# EAGLE design Arduino_Euclidean_Board_Controls_top (EAGLE 9.1.1)
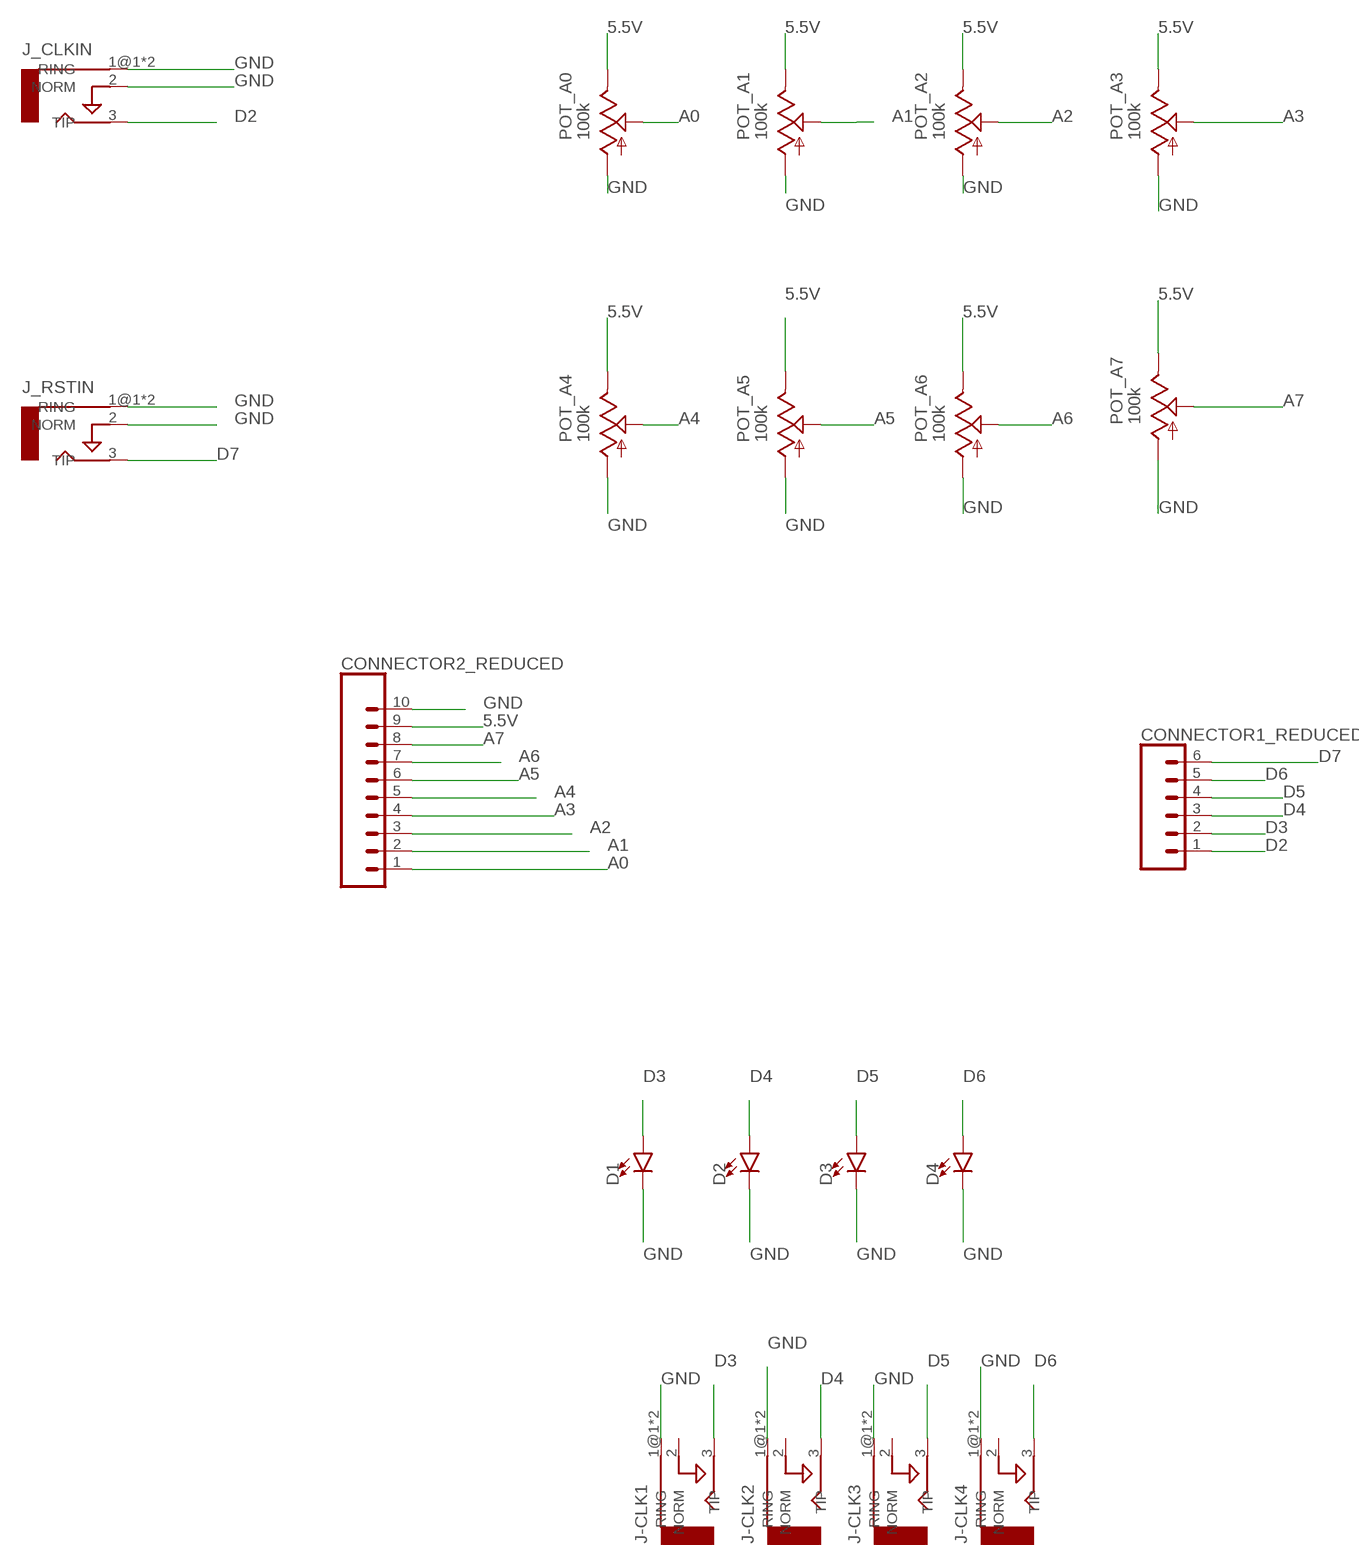
[diagram p0: schematic, sheet 1]

## Parts
CONNECTOR1_REDUCED  CONN_06LONGPADS  [1X06_LONGPADS]
CONNECTOR2_REDUCED  CONN_10_LONGPADS10_LONGPADS  [1X10_LONGPADS]
D1  LED-3MM-NO_SILK  [LED_3MM-NS]
D2  LED-3MM-NO_SILK  [LED_3MM-NS]
D3  LED-3MM-NO_SILK  [LED_3MM-NS]
D4  LED-3MM-NO_SILK  [LED_3MM-NS]
J-CLK1  AUDIO-JACKERTHENVAR  [ERTHENVAR-JACK]
J-CLK2  AUDIO-JACKERTHENVAR  [ERTHENVAR-JACK]
J-CLK3  AUDIO-JACKERTHENVAR  [ERTHENVAR-JACK]
J-CLK4  AUDIO-JACKERTHENVAR  [ERTHENVAR-JACK]
J_CLKIN  AUDIO-JACKERTHENVAR  [ERTHENVAR-JACK]
J_RSTIN  AUDIO-JACKERTHENVAR  [ERTHENVAR-JACK]
POT_A0  100k  9MM_SNAP-IN_POT_  [9MM_SNAP-IN_POT]
POT_A1  100k  9MM_SNAP-IN_POT_  [9MM_SNAP-IN_POT]
POT_A2  100k  9MM_SNAP-IN_POT_  [9MM_SNAP-IN_POT]
POT_A3  100k  9MM_SNAP-IN_POT_  [9MM_SNAP-IN_POT]
POT_A4  100k  9MM_SNAP-IN_POT_  [9MM_SNAP-IN_POT]
POT_A5  100k  9MM_SNAP-IN_POT_  [9MM_SNAP-IN_POT]
POT_A6  100k  9MM_SNAP-IN_POT_  [9MM_SNAP-IN_POT]
POT_A7  100k  9MM_SNAP-IN_POT_  [9MM_SNAP-IN_POT]

## Nets
5.5V: CONNECTOR2_REDUCED.9 POT_A0.3(E) POT_A1.3(E) POT_A2.3(E) POT_A3.3(E) POT_A4.3(E) POT_A5.3(E) POT_A6.3(E) POT_A7.3(E)
A0: CONNECTOR2_REDUCED.1 POT_A0.2(S)
A1: CONNECTOR2_REDUCED.2 POT_A1.2(S)
A2: CONNECTOR2_REDUCED.3 POT_A2.2(S)
A3: CONNECTOR2_REDUCED.4 POT_A3.2(S)
A4: CONNECTOR2_REDUCED.5 POT_A4.2(S)
A5: CONNECTOR2_REDUCED.6 POT_A5.2(S)
A6: CONNECTOR2_REDUCED.7 POT_A6.2(S)
A7: CONNECTOR2_REDUCED.8 POT_A7.2(S)
D2: CONNECTOR1_REDUCED.1 J_CLKIN.3(TIP)
D3: CONNECTOR1_REDUCED.2 D1.A J-CLK1.3(TIP)
D4: CONNECTOR1_REDUCED.3 D2.A J-CLK2.3(TIP)
D5: CONNECTOR1_REDUCED.4 D3.A J-CLK3.3(TIP)
D6: CONNECTOR1_REDUCED.5 D4.A J-CLK4.3(TIP)
D7: CONNECTOR1_REDUCED.6 J_RSTIN.3(TIP)
GND: CONNECTOR2_REDUCED.10 D1.K(C) D2.K(C) D3.K(C) D4.K(C) J-CLK1.1@1(RING) J-CLK1.1@2(RING) J-CLK2.1@1(RING) J-CLK2.1@2(RING) J-CLK3.1@1(RING) J-CLK3.1@2(RING) J-CLK4.1@1(RING) J-CLK4.1@2(RING) J_CLKIN.1@1(RING) J_CLKIN.1@2(RING) J_CLKIN.2(NORM) J_RSTIN.1@1(RING) J_RSTIN.1@2(RING) J_RSTIN.2(NORM) POT_A0.1(A) POT_A1.1(A) POT_A2.1(A) POT_A3.1(A) POT_A4.1(A) POT_A5.1(A) POT_A6.1(A) POT_A7.1(A)
Unconnected: J-CLK1.2(NORM) J-CLK2.2(NORM) J-CLK3.2(NORM) J-CLK4.2(NORM)

## Library data of the parts
CONNECTOR1_REDUCED = SparkFun-Connectors:CONN_06: Multi connection point. Often used as Generic Header-pin footprint for 0.1 inch spaced/style header connections On any of the 0.1 inch spaced packages, you can populate with these: Break Away Headers - Straight <https://www.sparkfun.com/products/116> (PRT-00116) Break Away Male Headers - Right Angle <https://www.sparkfun.com/products/553> (PRT-00553) Female Headers <https://www.sparkfun.com/products/115> (PRT-00115) Break Away Headers - Machine Pin <https://www.sparkfun.com/products/117> (PRT-00117) Break Away Female Headers - Swiss Machine Pin <https://www.sparkfun.com/products/743> (PRT-00743) Arduino Stackable Header - 6 Pin <https://www.sparkfun.com/products/9280> (PRT-09280) For SCREWTERMINALS and SPRING TERMINALS visit here: Screw Terimnals on SparkFun.com <https://www.sparkfun.com/search/results?term=Screw+Terminals> (5mm/3.5mm/2.54mm spacing) This device is also useful as a general connection point to wire up your design to another part of your project. Our various solder wires solder well into these plated through hole pads. Hook-Up Wire - Assortment (Stranded, 22 AWG) <https://www.sparkfun.com/products/11375> (PRT-11375) Hook-Up Wire - Assortment (Solid Core, 22 AWG) <https://www.sparkfun.com/products/11367> (PRT-11367) View the entire wire category on our website here <https://www.sparkfun.com/categories/141>
CONNECTOR2_REDUCED = 10_Long_Pads:CONN_10_LONGPADS: Multi connection point. Often used as Generic Header-pin footprint for 0.1 inch spaced/style header connections On any of the 0.1 inch spaced packages, you can populate with these: Break Away Headers - Straight <https://www.sparkfun.com/products/116> (PRT-00116) Break Away Male Headers - Right Angle <https://www.sparkfun.com/products/553> (PRT-00553) Female Headers <https://www.sparkfun.com/products/115> (PRT-00115) Break Away Headers - Machine Pin <https://www.sparkfun.com/products/117> (PRT-00117) Break Away Female Headers - Swiss Machine Pin <https://www.sparkfun.com/products/743> (PRT-00743) For SCREWTERMINALS and SPRING TERMINALS visit here: Screw Terimnals on SparkFun.com <https://www.sparkfun.com/search/results?term=Screw+Terminals> (5mm/3.5mm/2.54mm spacing) This device is also useful as a general connection point to wire up your design to another part of your project. Our various solder wires solder well into these plated through hole pads. Hook-Up Wire - Assortment (Stranded, 22 AWG) <https://www.sparkfun.com/products/11375> (PRT-11375) Hook-Up Wire - Assortment (Solid Core, 22 AWG) <https://www.sparkfun.com/products/11367> (PRT-11367) View the entire wire category on our website here <https://www.sparkfun.com/categories/141>
D1-D4 = SparkFun-LED:LED: LED (Generic) Standard schematic elements and footprints for 5mm, 3mm, 1206, and 0603 sized LEDs. Generic LEDs with no color specified.
J-CLK1-J-CLK4 J_CLKIN J_RSTIN = erthenvar:AUDIO-JACK: Switching Mono 3.5mm Audio Jack from Erthenvar.
POT_A0 POT_A1-POT_A7 = MusicThingModular:9MM_SNAP-IN_POT: 9mm vertical snap-in pot, Alpha / Panasonic style

## Board
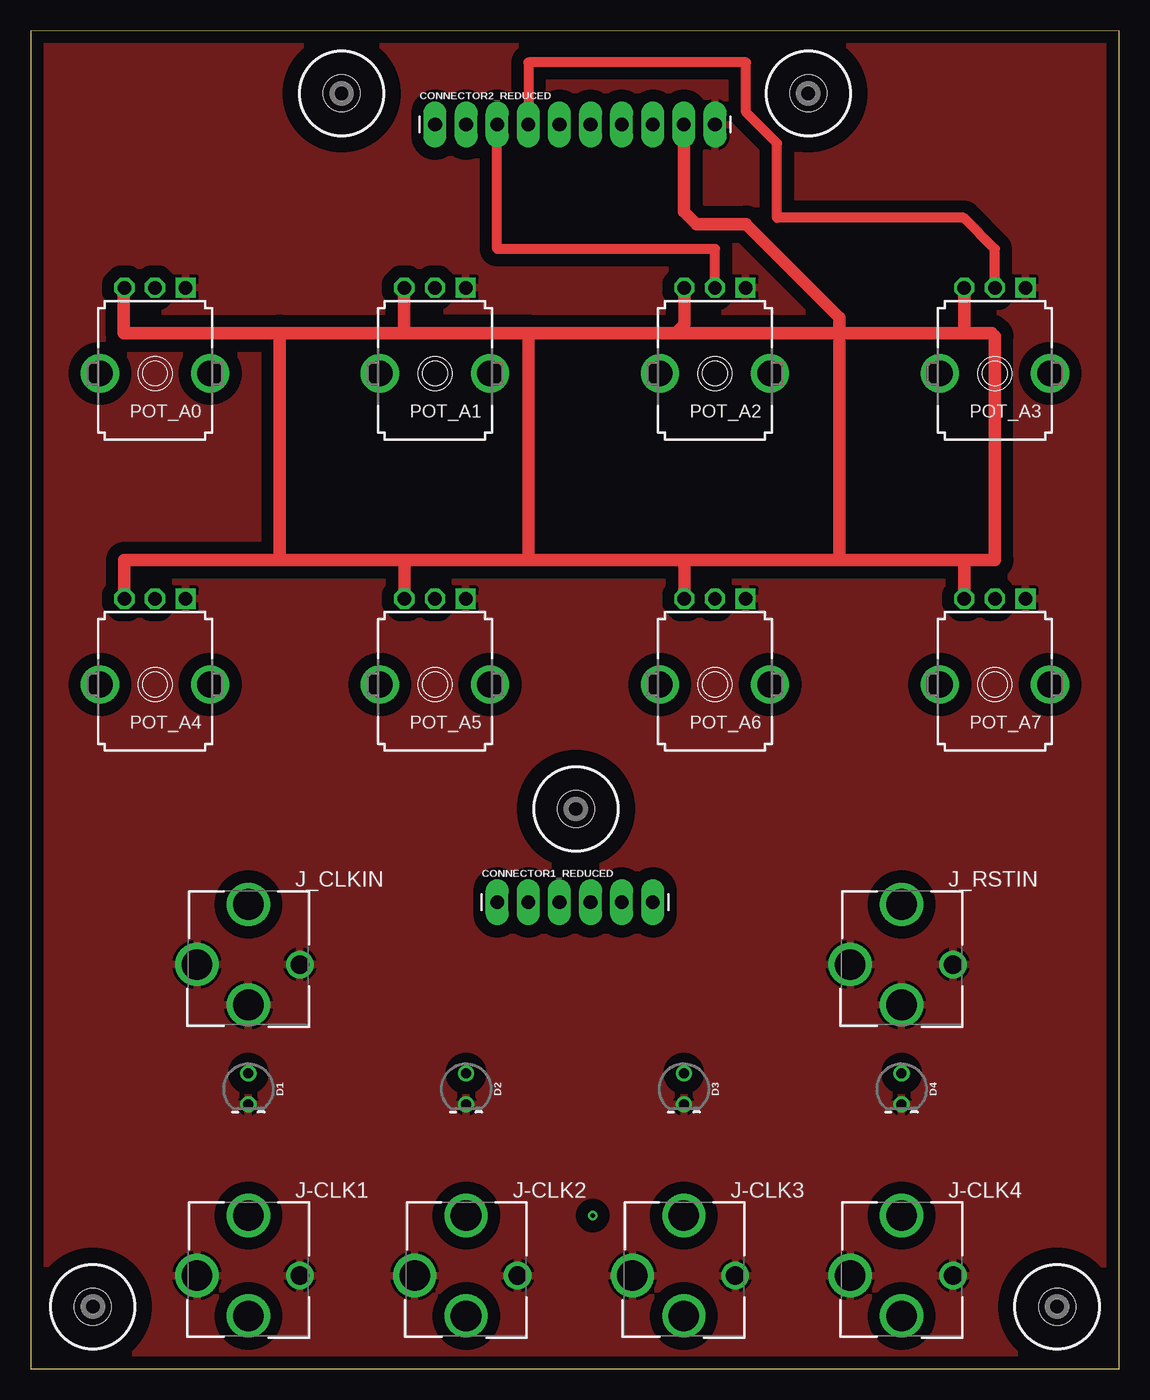
[diagram p1: board, top side]
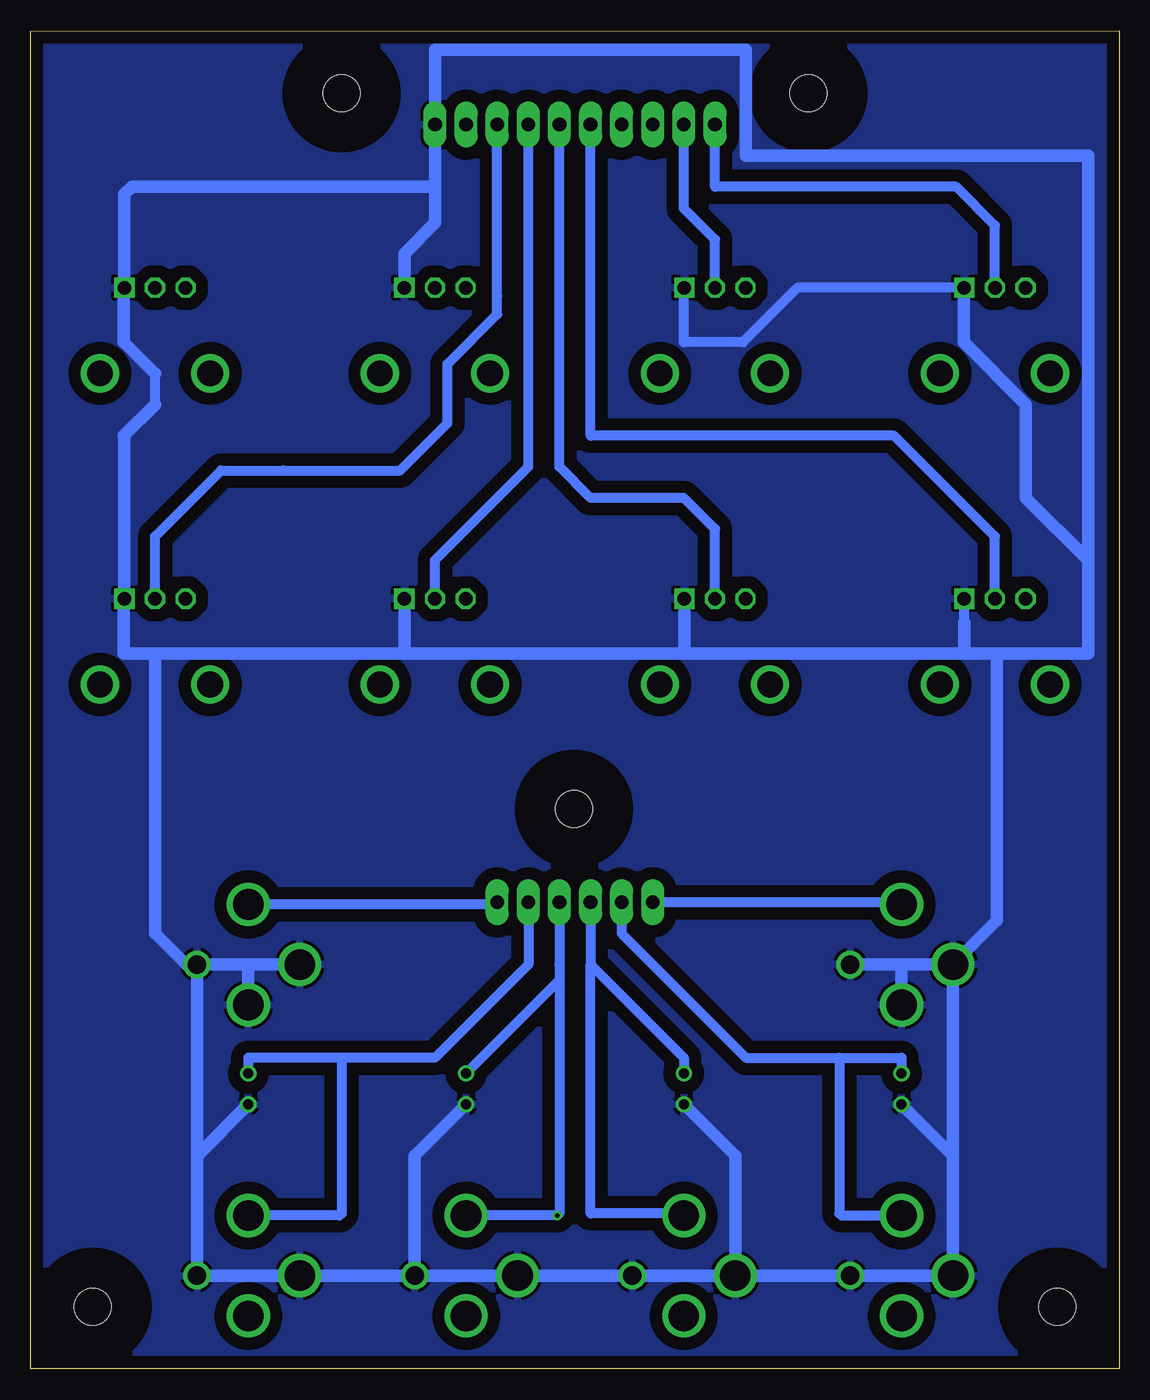
[diagram p2: board, bottom side, seen from below]

Size 88.9 x 109.27 mm. Coordinates in mm from the lower left corner, seen from the top.
Outline: 0,0 88.9,0 88.9,109.22 0,109.27 0,0
Copper layers (1*16): Top 0.035mm / dielectric 1.5mm / Bottom 0.035mm
Design rules "default": minimum track width 6mil, minimum drill 0.35mm, track to track 6mil, track to pad 6mil, pad to pad 6mil, via to via 6mil, smd to smd 6mil, copper to edge 40mil, drill to drill 6mil, minimum pad ring 10mil, minimum via ring 8mil, stop-mask expansion 4mil, vias tented up to drill 0mil, thermal gap 10mil

### Footprints (pad centres in the part's own frame; a part is rotated, then mirrored left to right if it is on the bottom)
1X06_LONGPADS = drill 1.118 pad 1.88 long: 1 0,0; 2 2.54,0; 3 5.08,0; 4 7.62,0; 5 10.16,0; 6 12.7,0
1X10_LONGPADS = drill 1.118 pad 1.88 long: 1 0,0; 2 2.54,0; 3 5.08,0; 4 7.62,0; 5 10.16,0; 6 12.7,0; 7 15.24,0; 8 17.78,0; 9 20.32,0; 10 22.86,0
LED_3MM-NS = drill 0.813: A -1.27,0; K 1.27,0
DRIL-3 = hole 3: 0,0
ERTHENVAR-JACK = drill 2.5: 1@1 -4.2,0; 2 0,-3.3; 3 0,4.9 | drill 1.5: 1@2 4.2,0
9MM_SNAP-IN_POT = drill 1.1 square: 1 -2.5,-7 | drill 1.1 octagon: 2 0,-7; 3 2.5,-7 | drill 2.1 pad 2.794: CHASSIS1 -4.5,0; CHASSIS2 4.5,0

### Placement (x,y rotation side)
CONNECTOR1_REDUCED  38.1,38.1 0 top
CONNECTOR2_REDUCED  33.02,101.6 0 top
D1  17.78,22.86 270 top
D2  35.56,22.86 270 top
D3  53.34,22.86 270 top
D4  71.12,22.86 270 top
H1  [DRIL-3]  25.4,104.14 0 top
H2  [DRIL-3]  63.5,104.14 0 top
H3  [DRIL-3]  83.82,5.08 0 top
H4  [DRIL-3]  5.08,5.08 0 top
H5  [DRIL-3]  44.52,45.72 0 top
J-CLK1  17.78,7.62 0 top
J-CLK2  35.56,7.62 0 top
J-CLK3  53.34,7.62 0 top
J-CLK4  71.12,7.62 0 top
J_CLKIN  17.78,33.02 0 top
J_RSTIN  71.12,33.02 0 top
POT_A0  10.16,81.28 180 top
POT_A1  33.02,81.28 180 top
POT_A2  55.88,81.28 180 top
POT_A3  78.74,81.28 180 top
POT_A4  10.16,55.88 180 top
POT_A5  33.02,55.88 180 top
POT_A6  55.88,55.88 180 top
POT_A7  78.74,55.88 180 top

### Tracks (layer width: path | path; a pad name or v marks a point on that pad's centre or on a via)
5.5V
  Top 0.813: 30.48,88.24 POT_A1.3 | 30.48,62.84 POT_A5.3 | 10.16,66.04 20.32,66.04 | 30.52,66 30.48,66.04 | 53.38,66 53.34,66.04 | POT_A0.3 7.62,88.24
  Top 1.016: 30.48,84.58 30.48,88.24 | POT_A3.3 76.24,84.84 75.99,84.58 | POT_A7.3 76.24,66.04 | 20.32,84.58 30.48,84.58 | POT_A4.3 7.66,66.04 10.16,66.04 17.78,66.04 20.32,66.04 | 20.32,66.04 30.48,66.04 40.64,66.04 | 66.04,66.04 53.34,66.04 45.72,66.04 43.18,66.04 40.64,66.04 | 76.24,66.04 76.36,66.04 | POT_A5.3 30.52,66 | POT_A6.3 53.38,66 | 40.64,84.58 40.64,83.82 40.64,66.04 | 66.04,83.82 66.04,66.04 | 66.04,66.04 68.58,66.04 76.24,66.04 | 40.64,84.58 30.48,84.58 | 7.62,88.24 7.62,84.58 9.4,84.58 20.32,84.58 | 76.24,66.04 78.74,66.04 78.74,84.33 78.49,84.58 75.99,84.58 | 20.32,84.58 20.32,83.82 20.32,66.04 | 40.64,84.58 52.66,84.58 | 52.66,84.58 66.04,84.58 | 66.04,84.58 75.99,84.58 | CONNECTOR2_REDUCED.9 53.34,94.49 54.36,93.47 58.42,93.47 66.04,85.85 66.04,84.58 | 52.66,84.58 53.38,85.3 POT_A2.3
  Bottom 0.813: 53.38,101.56 CONNECTOR2_REDUCED.9
A0
  Bottom 0.813: CONNECTOR2_REDUCED.1 33.02,96.52 13.32,96.52 10.16,93.36 POT_A0.2
A1
  Bottom 0.813: POT_A1.2 33.02,92.2 35.56,94.74 CONNECTOR2_REDUCED.2
A2
  Top 0.813: POT_A2.2 55.88,91.44 38.1,91.44 CONNECTOR2_REDUCED.3
A3
  Top 0.813: POT_A3.2 78.74,91.44 76.2,93.98 60.96,93.98 60.96,100.08 58.42,102.62 58.42,106.68 40.64,106.68 CONNECTOR2_REDUCED.4
A4
  Bottom 0.813: CONNECTOR2_REDUCED.5 43.18,76.2 18.4,76.2 10.16,67.96 POT_A4.2
A5
  Bottom 0.813: CONNECTOR2_REDUCED.6 45.72,73.66 43.18,71.12 35.56,71.12 33.02,68.58 POT_A5.2
A6
  Bottom 0.813: POT_A6.2 55.88,66.04 48.26,73.66 CONNECTOR2_REDUCED.7
A7
  Bottom 0.813: CONNECTOR2_REDUCED.8 50.8,87.63 50.8,86.11 54.86,82.04 54.86,77.22 58.73,73.35 68.27,73.35 73.35,73.35 78.74,67.96 POT_A7.2
D2
  Bottom 0.813: J_CLKIN.3 17.96,38.1 CONNECTOR1_REDUCED.1
D3
  Bottom 0.813: CONNECTOR1_REDUCED.2 40.64,35.56 30.48,25.4 22.86,25.4 | 22.86,25.4 17.78,25.4 D1.A | 22.86,25.4 22.86,12.7 22.68,12.52 J-CLK1.3
D4
  Bottom 0.813: CONNECTOR1_REDUCED.3 43.18,33.02 | 43.18,33.02 35.56,25.4 D2.A | 43.18,33.02 43.18,12.7 35.74,12.7 J-CLK2.3
D5  (via drill 0.35)
  Bottom 0.813: J-CLK3.3 v45.9,12.52 45.72,12.7 45.72,33.02 | D3.A 45.72,31.75 45.72,33.02 | CONNECTOR1_REDUCED.4 45.72,33.02
D6
  Bottom 0.813: CONNECTOR1_REDUCED.5 48.26,33.02 55.88,25.4 63.5,25.4 | 63.5,25.4 71.12,25.4 D4.A | 63.5,25.4 63.5,12.7 63.68,12.52 J-CLK4.3
D7
  Bottom 0.813: CONNECTOR1_REDUCED.6 50.98,37.92 J_RSTIN.3
GND
  Bottom 0.813: 22.86,7.62 J-CLK1.1@2 | 40.64,7.62 J-CLK2.1@2 | 12.7,88.24 POT_A0.1 26.27,88.28 30.73,83.82 35.56,83.82 35.56,88.24 POT_A1.1 | 10.16,58.42 10,58.26 9.85,58.42 | 12.7,58.42 12.66,58.46 | 12.66,60.96 POT_A4.1 | 35.56,58.42 35.52,58.46 | 58.42,58.42 58.38,58.46 | 81.24,76.16 81.28,76.2 | 78.74,78.74 78.74,81.28 | 81.28,88.9 81.28,88.32 POT_A3.1 | 76.2,33.02 J_RSTIN.1@2 | 81.28,62.84 POT_A7.1
  Bottom 1.016: J-CLK2.1@1 22.86,7.62 17.78,7.62 J-CLK1.1@1 13.58,17.39 | J-CLK3.1@2 J-CLK4.1@1 71.12,7.62 J-CLK4.1@2 75.32,17.39 | J-CLK2.1@1 35.56,7.62 40.64,7.62 J-CLK3.1@1 53.34,7.62 J-CLK3.1@2 | 13.58,17.39 D1.K | 75.32,17.39 D4.K | J_CLKIN.1@2 17.78,33.02 | 17.78,33.02 J_CLKIN.1@1 | J_RSTIN.1@1 71.12,33.02 | 71.12,33.02 J_RSTIN.1@2 75.32,17.39 | J_RSTIN.2 71.12,33.02 | J_CLKIN.2 17.78,33.02 | J_CLKIN.1@1 13.58,17.39 | J_CLKIN.1@1 10,36.6 10,54.22 10,58.26 | J-CLK3.1@2 57.54,17.39 D3.K | J-CLK2.1@1 31.36,17.39 D2.K | 55.88,96.52 80.62,96.52 81.24,95.9 POT_A3.1 | 55.88,96.52 55.88,99.06 CONNECTOR2_REDUCED.10 55.88,107.7 30.48,107.7 30.48,99.06 2.54,99.06 2.54,66.04 | 10.16,58.42 12.7,58.42 35.56,58.42 58.42,58.42 78.74,58.42 | 12.66,58.46 12.66,60.96 | 35.52,58.46 POT_A5.1 | 58.38,58.46 POT_A6.1 | 9.85,58.42 2.54,58.42 2.54,66.04 | 2.54,66.04 7.62,71.12 7.62,78.74 12.7,83.82 12.7,88.24 | POT_A2.1 58.38,91.07 55.88,93.57 55.88,96.52 | POT_A7.1 81.24,76.16 | 81.28,76.2 78.74,78.74 | 78.74,81.28 81.28,83.82 81.28,88.9 | 78.74,58.42 81.28,58.42 81.28,62.84 | 78.74,58.42 78.74,35.56 76.2,33.02
  pour Top (isolate 1): 0,0 0,109.22 88.39,109.22 88.9,109.73 88.9,0
  pour Bottom (isolate 1): 0,0 88.9,0 88.9,108.71 88.39,109.22 0,109.22

### Text on the board
tDocu: A0 | A7 | 5.5V | GND | D2 | D7